# EAGLE design FLK01A (EAGLE 6.5.0)
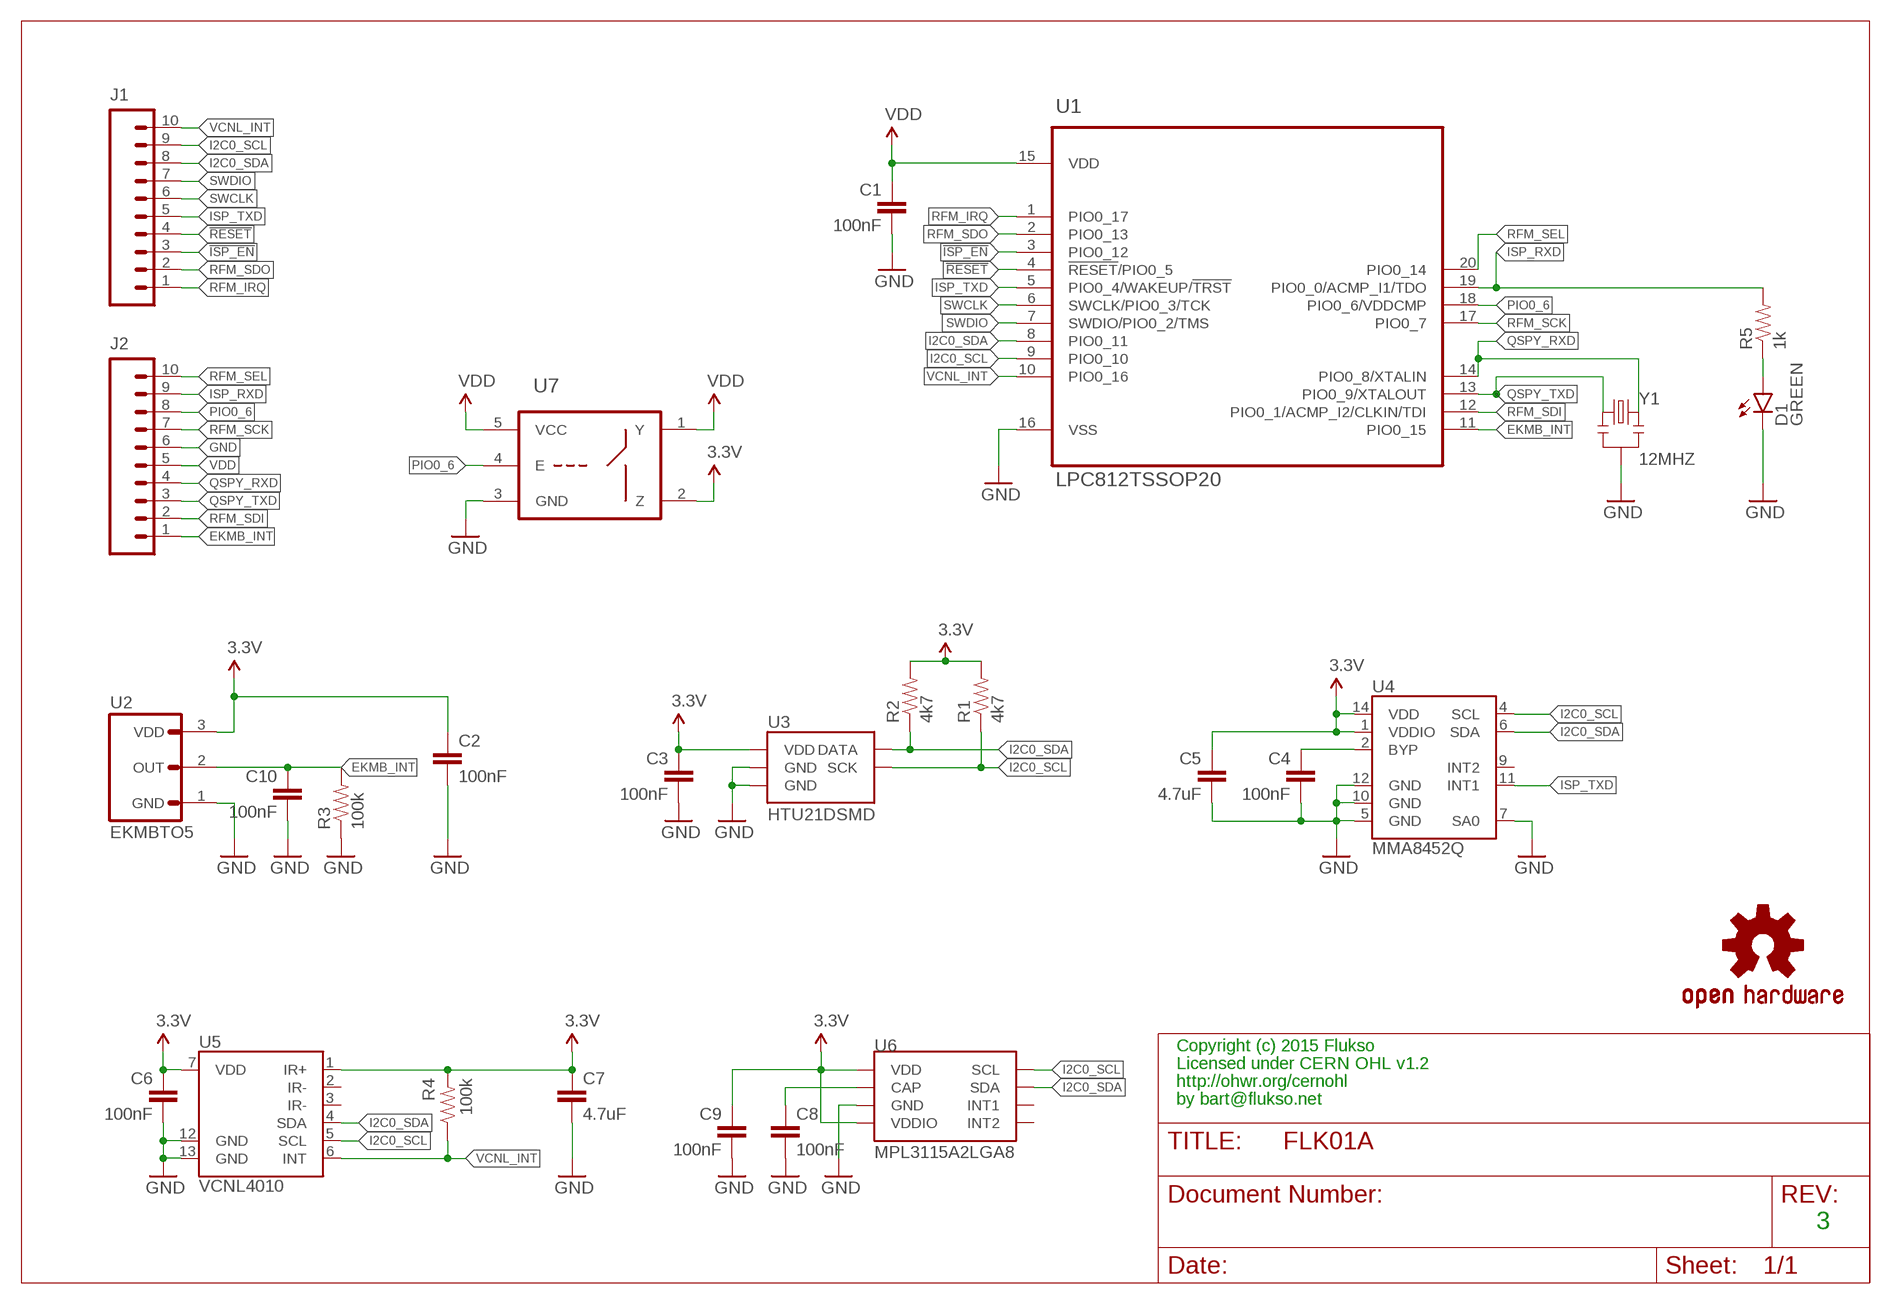
[diagram p0: schematic, sheet 1]

## Parts
C1  100nF  CAP0402-CAP  [0402-CAP]
C2  100nF  CAP0402-CAP  [0402-CAP]
C3  100nF  CAP0402-CAP  [0402-CAP]
C4  100nF  CAP0402-CAP  [0402-CAP]
C5  4.7uF  CAP0805-CAP  [C0805K]
C6  100nF  CAP0402-CAP  [0402-CAP]
C7  4.7uF  CAP0805-CAP  [C0805K]
C8  100nF  CAP0402-CAP  [0402-CAP]
C9  100nF  CAP0402-CAP  [0402-CAP]
C10  100nF  CAP0402-CAP  [0402-CAP]
D1  GREEN  LED-GREEN0603  [LED-0603]
J1  M10SMD_MALE_SHORT  [1X10_SMD_MALE_SHORT]
J2  M10SMD_MALE_SHORT  [1X10_SMD_MALE_SHORT]
R1  4k7  RESISTOR0402-RES  [0402-RES]
R2  4k7  RESISTOR0402-RES  [0402-RES]
R3  100k  RESISTOR0402-RES  [0402-RES]
R4  100k  RESISTOR0402-RES  [0402-RES]
R5  1k  RESISTOR0402-RES  [0402-RES]
U1  LPC812TSSOP20  [TSSOP20]
U2  EKMBTO5  [TO5]
U3  HTU21DSMD  [HTU21D]
U4  MMA8452Q  [QFN-16_0.5MM]
U5  VCNL4010  [VCNL4010]
U6  MPL3115A2LGA8  [LGA8]
U7  741G66  [SOT353]
U$1  OSHW-LOGOS  [OSHW-LOGO-S]
Y1  12MHZ  RESONATOR8MHZ  [RESONATOR-SMD]

## Nets
3.3V: C2.1 C3.1 C5.1 C6.1 C7.1 C9.1 R1.2 R2.2 R4.2 U2.3(VDD) U3.VDD U4.1(VDDIO) U4.14(VDD) U5.1(IR+) U5.7(VDD) U6.1(VDD) U6.4(VDDIO) U7.2(Z)
!ISP_EN!: J1.3 U1.3(PIO0_12)
!RESET!: J1.4 U1.4(!RESET!/PIO0_5)
EKMB_INT: C10.1 J2.1 R3.2 U1.11(PIO0_15) U2.2(OUT)
GND: C1.2 C2.2 C3.2 C4.2 C5.2 C6.2 C7.2 C8.2 C9.2 C10.2 D1.C J2.6 R3.1 U1.16(VSS) U2.1(GND) U3.7(GND) U3.GND U4.5(GND) U4.7(SA0) U4.10(GND) U4.12(GND) U5.12(GND) U5.13(GND) U6.3(GND) U7.3(GND) Y1.2
I2C0_SCL: J1.9 R1.1 U1.9(PIO0_10) U3.SCK U4.4(SCL) U5.5(SCL) U6.8(SCL)
I2C0_SDA: J1.8 R2.1 U1.8(PIO0_11) U3.DATA U4.6(SDA) U5.4(SDA) U6.7(SDA)
ISP_RXD: J2.9 R5.2 U1.19(PIO0_0/ACMP_I1/TDO)
ISP_TXD: J1.5 U1.5(PIO0_4/WAKEUP/!TRST!) U4.11(INT1)
N$3: C4.1 U4.2(BYP)
N$6: C8.1 U6.2(CAP)
N$8: D1.A R5.1
PIO0_6: J2.8 U1.18(PIO0_6/VDDCMP) U7.4(E)
QSPY_RXD: J2.4 U1.14(PIO0_8/XTALIN) Y1.3
QSPY_TXD: J2.3 U1.13(PIO0_9/XTALOUT) Y1.1
RFM_IRQ: J1.1 U1.1(PIO0_17)
RFM_SCK: J2.7 U1.17(PIO0_7)
RFM_SDI: J2.2 U1.12(PIO0_1/ACMP_I2/CLKIN/TDI)
RFM_SDO: J1.2 U1.2(PIO0_13)
RFM_SEL: J2.10 U1.20(PIO0_14)
SWCLK: J1.6 U1.6(SWCLK/PIO0_3/TCK)
SWDIO: J1.7 U1.7(SWDIO/PIO0_2/TMS)
VCNL_INT: J1.10 R4.1 U1.10(PIO0_16) U5.6(INT)
VDD: C1.1 J2.5 U1.15(VDD) U7.1(Y) U7.5(VCC)
Unconnected: U4.9(INT2) U5.2(IR-) U5.3(IR-) U6.5(INT2) U6.6(INT1)

## Notes on the sheet
- Copyright (c) 2015 Flukso
- Licensed under CERN OHL v1.2
- http://ohwr.org/cernohl
- by bart@flukso.net
- 3

## Library data of the parts
C1-C10 = flukso:CAP: Capacitor Standard 0603 ceramic capacitor, and 0.1" leaded capacitor.
D1 = SparkFun-LED:LED-GREEN: Various green LEDs Green LEDs used in SFE Production 0603- DIO-00821 LARGE- DIO-00862 LILYPAD- DIO-09910; PROD_ID: DIO-00821
J1 J2 = flukso:M10: Header 10 Standard 10-pin 0.1" header. Use with straight break away headers (SKU : PRT-00116), right angle break away headers (PRT-00553), swiss pins (PRT-00743), machine pins (PRT-00117), and female headers (PRT-00115).
R1-R5 = SparkFun-Passives:RESISTOR: Resistor Basic schematic elements and footprints for 0603, 1206, and PTH resistors.
U1 = flukso:LPC812: IC, 32-bit ARM Cortex-M0+ microcontroller 16 kB flash and 4 kB SRAM
U2 = flukso:EKMB
U3 = flukso:HTU21D
U4 = SparkFun-Sensors:MMA8452Q: MMA8452Q 3-Axis, 12/8-bit Digital Accelerometer Supply Voltage: 1.6-3.6V Range: +/- 2g, 4g, 8g Interface: I2C, 12-bit and 8-bit ODR: 1.56 Hz - 800 Hz Package: QFN-16 http://cache.freescale.com/files/sensors/doc/data_sheet/MMA8452Q.pdf; PROD_ID: IC-10769
U5 = flukso:VCNL4010: Fully integrated proximity and ambient light sensor with infrared emitter and I2C interface
U6 = SparkFun-Sensors:MPL3115A2: Altimeter/Pressure Sensor, I2C, 1.95V-3.6V supply, 50 to 110kPa
U7 = flukso:74*1G66: Analog switch
U$1 = sparkFun:OSHW-LOGO: Open Source Hardware Logo This logo indicates the piece of hardware it is found on incorporates a OSHW license and/or adheres to the definition of open source hardware found here: http://freedomdefined.org/OSHW
Y1 = SparkFun-FreqCtrl:RESONATOR: Resonator Small SMD resonator. Used, eg, on the Arduino Pro/ Pro Mini boards. 8MHz- XTAL-08895 16MHz- XTAL-08900; PROD_ID: XTAL-08895; VALUE: 8MHZ

## Net classes
0 default: width 0.2 mm
1 power: width 0.305 mm

## Board
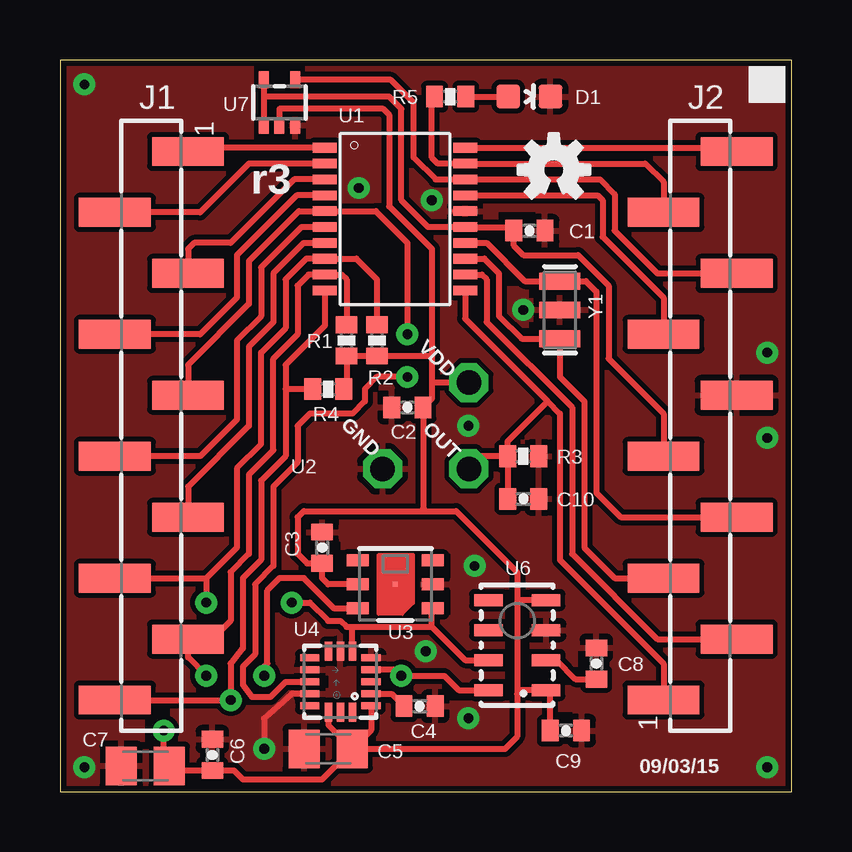
[diagram p1: board, top side]
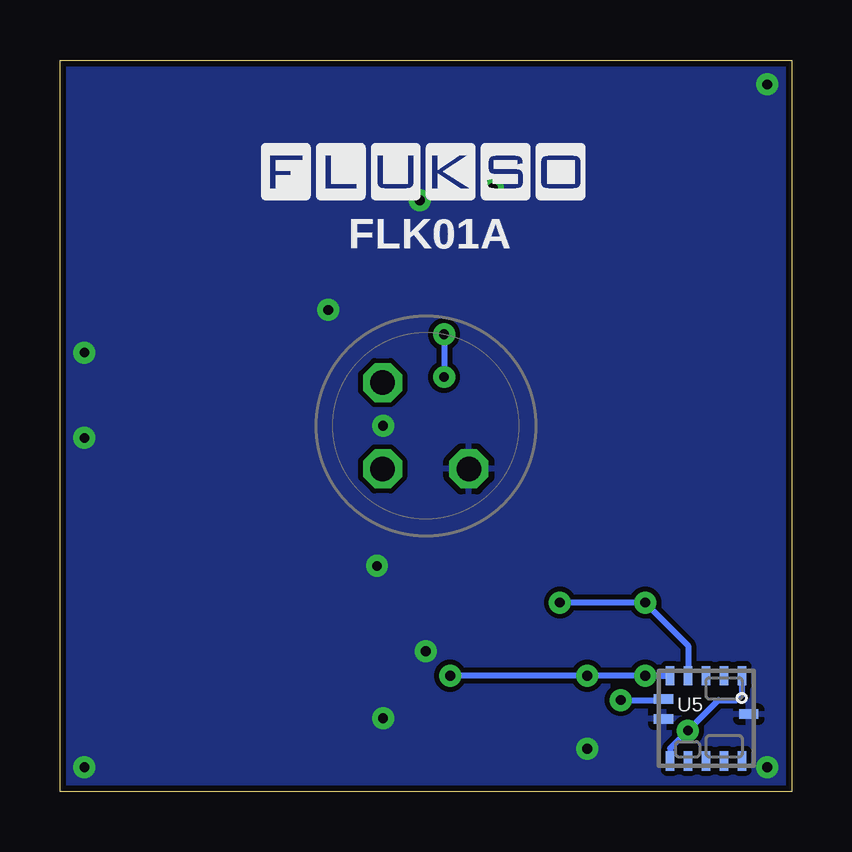
[diagram p2: board, bottom side, seen from below]

Size 30.48 x 30.48 mm. Coordinates in mm from the lower left corner, seen from the top.
Outline: 0,0 30.48,0 30.48,30.48 0,30.48 0,0
Copper layers (1*16): Top 0.035mm / dielectric 1.5mm / Bottom 0.035mm
Design rules "sparkfun": minimum track width 8mil, minimum drill 16mil, track to track 8mil, track to pad 8mil, pad to pad 8mil, via to via 8mil, smd to smd 8mil, copper to edge 10mil, drill to drill 8mil, minimum pad ring 12mil, minimum via ring 10mil, stop-mask expansion 4mil, vias tented up to drill 25mil, thermal gap 10mil
tRestrict: area 11.4,9.9 to 11.7,10.4; area 18.5,3.8 to 18.8,8.4; area 19.3,4.6 to 19.6,7.6; area 18.3,23.9 to 19.8,24.1; area 18.8,12.7 to 19.8,13.5; area 20.1,12.7 to 20.6,13.5; area 18.5,21.1 to 19,21.3; area 19.3,19.1 to 19.8,19.3; area 19.6,19.3 to 19.8,19.6; area 19.6,20.6 to 19.8,21.1; area 15,8.1 to 16,8.4; area 16,8.9 to 16.3,9.9; 8 more areas

### Footprints (pad centres in the part's own frame; a part is rotated, then mirrored left to right if it is on the bottom)
0402-CAP = smd 0.7 x 0.9: 1 -0.65,0; 2 0.65,0
C0805K = smd 1.3 x 1.6: 1 -1,0; 2 1,0
LED-0603 = smd 1 x 1: A 0,-0.877; C 0,0.877
1X10_SMD_MALE_SHORT = smd 1.2 x 2.997: 1 0,1.524; 2 2.54,-1.524; 3 5.08,1.524; 4 7.62,-1.524; 5 10.16,1.524; 6 12.7,-1.524; 7 15.24,1.524; 8 17.78,-1.524; 9 20.32,1.524; 10 22.86,-1.524
0402-RES = smd 0.7 x 0.9: 1 -0.65,0; 2 0.65,0
TSSOP20 = smd 1 x 0.4: 1 -2.937,2.693; 2 -2.937,2.032; 3 -2.937,1.372; 4 -2.937,0.712; 5 -2.937,0.051; 6 -2.937,-0.609; 7 -2.937,-1.27; 8 -2.943,-1.93; 9 -2.937,-2.59; 10 -2.937,-3.251; 11 2.905,-3.251; 12 2.905,-2.59; 13 2.911,-1.93; 14 2.905,-1.27; 15 2.905,-0.609; 16 2.905,0.051; 17 2.905,0.712; 18 2.905,1.372; 19 2.905,2.032; 20 2.905,2.693
TO5 = drill 1.016 octagon: 1 0,-2.54; 2 2.54,0; 3 0,2.54
HTU21D = smd 0.2 x 0.2: 7 0,0 | smd 0.927 x 0.5: DATA 1.563,-1; GND 1.563,0; NC@1 -1.563,1; NC@6 1.563,1; SCK -1.563,-1; VDD -1.563,0
QFN-16_0.5MM = smd 0.8 x 0.3: 1 -1.275,1; 2 -1.275,0.5; 3 -1.275,0; 4 -1.275,-0.5; 5 -1.275,-1; 9 1.275,-1; 10 1.275,-0.5; 11 1.275,0; 12 1.275,0.5; 13 1.275,1 | smd 0.3 x 0.8: 6 -0.5,-1.275; 7 0,-1.275; 8 0.5,-1.275; 14 0.5,1.275; 15 0,1.275; 16 -0.5,1.275
VCNL4010 = smd 0.35 x 0.805: 1 -1.5,-1.772; 2 -0.75,-1.772; 3 0,-1.772; 4 0.75,-1.772; 5 1.5,-1.772; 7 1.5,1.772; 8 0.75,1.772; 9 0,1.772; 10 -0.75,1.772; 11 -1.5,1.772 | smd 0.805 x 0.4: 6 1.772,-0.805; 12 -1.772,-0.175; 13 1.772,0.024
LGA8 = smd 1.2 x 0.5: 1 -1.2,1.875; 2 -1.2,0.625; 3 -1.2,-0.625; 4 -1.2,-1.875; 5 1.2,-1.875; 6 1.2,-0.625; 7 1.2,0.625; 8 1.2,1.875
SOT353 = smd 0.42 x 0.7: 1 -0.65,-0.95; 2 0,-0.95; 3 0.65,-0.95; 4 0.65,0.95; 5 -0.65,0.95
RESONATOR-SMD = smd 0.7 x 1.7: 1 -1.2,0; 2 0,0; 3 1.2,0

### Placement (x,y rotation side)
C1  19.56,23.37 0 top
C2  14.48,16 180 top
C3  10.92,10.16 90 top
C4  14.99,3.56 0 top
C5  11.18,1.78 180 top
C6  6.35,1.52 90 top
C7  3.56,1.07 180 top
C8  22.35,5.33 90 top
C9  21.08,2.54 0 top
C10  19.3,12.19 0 top
D1  19.56,28.96 270 top
J1  3.81,26.67 270 top
J2  26.67,3.81 90 top
R1  11.94,18.8 270 top
R2  13.21,18.8 270 top
R3  19.3,13.97 180 top
R4  11.18,16.76 0 top
R5  16.26,28.96 180 top
U1  13.97,24.13 0 top
U2  15.24,15.24 315 top
U3  13.97,8.64 0 top
U4  11.68,4.57 180 top
U5  3.56,3.05 180 bottom
U6  19.05,6.1 180 top
U7  9.14,28.7 0 top
U$1  20.57,25.91 0 top
U$2  [FLUKSO_LOGO_MEDIUM]  22.1,24.64 0 bottom
Y1  20.83,20.07 90 top

### Tracks (layer width: path | path; a pad name or v marks a point on that pad's centre or on a via)
3.3V  (via drill 0.41 pad 0.61)
  Top 0.254: 19.05,7.87 19.05,9.14 16.51,11.68 15.24,11.68 | 19.05,7.87 19.05,4.06 | U6.4 19.15,7.97 19.05,7.87 | 19.05,4.06 19.21,4.22 U6.1 20.43,4.04 C9.1 | 19.05,4.06 19.05,2.29 18.54,1.78 C5.1 | U7.2 9.14,28.45 13.46,28.45 13.72,28.19 13.72,24.38 15.49,22.61 15.49,18.16 | U3.VDD 11.18,8.64 10.92,8.89 C3.1 10.3,9.51 9.91,9.91 9.91,11.43 10.16,11.68 15.24,11.68 | 15.24,11.68 15.13,11.8 C2.1 15.49,16.37 15.49,17.02 | v4.32,2.54 4.32,1.07 C7.1 4.56,0.87 C6.1 7.25,0.87 7.62,0.51 10.92,0.51 12.18,1.76 C5.1 | R4.2 11.94,17.13 R1.2 R2.2 13.21,18.16 15.49,18.16 | 15.49,18.16 15.49,17.02 | U2.3 15.51,17.04 15.49,17.02 | U4.14 11.18,2.77 C5.1 | U4.1 12.96,2.56 C5.1
  Bottom 0.254: U5.7 5.06,1.8 v4.32,2.54 3.05,3.81 2.29,3.81 2.06,4.04 U5.1
!ISP_EN!
  Top 0.254: U1.3 9.75,25.5 7.11,22.86 5.59,22.86 5.33,22.61 J1.3
!RESET!
  Top 0.254: U1.4 9.86,24.84 7.37,22.35 7.37,20.57 5.84,19.05 J1.4
EKMB_INT
  Top 0.254: 16.97,20.88 U1.11 16.88,19.7 20.32,16.26 | R3.2 17.56,13.97 U2.2 | R3.2 C10.1 | J2.1 25.15,5.33 20.83,9.65 20.83,15.75 20.32,16.26 | R3.2 18.65,14.59 20.32,16.26
GND  (via drill 0.41 pad 0.61)
  Top 0.254: 16.46,24.18 U1.16 | U4.12 9.65,4.06 8.51,3.05 v8.51,1.78
  other vias: 19.3,20.07 15.49,24.64 29.46,18.29 29.46,14.73 1.02,29.46 1.02,1.02 17.27,9.4 29.46,1.02 17.02,15.24 17.02,3.05 12.45,25.15 15.24,5.84
  pour Top: 0,0 0,30.48 30.48,30.48 30.48,0
  pour Bottom: 0,0 0,30.48 30.48,30.48 30.48,0
I2C0_SCL  (via drill 0.41 pad 0.61)
  Top 0.254: R1.1 11.94,21.34 11.73,21.54 U1.9 10.36,21.54 9.91,21.08 9.91,19.05 8.89,18.03 8.89,14.22 7.87,13.21 7.87,9.91 7.11,9.14 7.11,7.11 6.35,6.35 J1.9 5.33,5.59 v6.1,4.83 | U3.SCK 12.39,7.62 11.43,7.62 10.16,8.89 9.14,8.89 8.64,8.38 8.64,5.33 8.51,5.21 v8.51,4.83 | U6.8 16.61,4.22 16.01,4.82 14.22,4.82 v14.22,4.83 13.98,5.07 U4.4
  Bottom 0.254: v6.1,4.83 v8.51,4.83 v14.22,4.83 | v6.1,4.83 6.34,4.82 | v6.1,4.83 v6.09,4.82 U5.5
I2C0_SDA  (via drill 0.41 pad 0.61)
  Top 0.254: R2.1 13.21,21.34 12.34,22.2 U1.8 10.26,22.2 9.4,21.34 9.4,19.3 8.38,18.29 8.38,14.48 7.37,13.46 7.37,10.16 6.1,8.89 | J1.8 6.1,8.89 | v9.65,7.87 10.41,7.87 11.18,7.11 11.68,7.11 11.94,6.86 | 15.49,6.86 16.88,5.47 U6.7 | 11.94,6.86 12.19,6.86 | 12.19,6.86 15.49,6.86 | 11.93,6.85 11.94,6.86 | 15.49,6.86 15.49,7.6 U3.DATA | 6.1,8.89 v6.1,7.87 | U4.6 12.18,6.85 12.19,6.86
  Bottom 0.254: v9.65,7.87 v6.1,7.87 4.31,6.08 U5.4
ISP_RXD
  Top 0.254: J2.9 25.15,25.4 24.38,26.16 U1.19 15.75,26.16 15.49,26.42 15.49,28.84 R5.2
ISP_TXD  (via drill 0.41 pad 0.61)
  Top 0.254: J1.5 5.33,17.78 7.87,20.32 7.87,22.1 9.96,24.18 U1.5 13.16,24.18 14.48,22.86 v14.48,19.05 | v14.48,17.27 13.21,17.27 12.7,16.76 12.7,16.26 12.19,15.75 10.41,15.75 9.91,15.24 9.91,13.72 8.89,12.7 8.89,9.4 8.13,8.64 8.13,5.71 7.62,5.21 7.62,4.45 8,3.94 8.76,3.94 9.4,4.57 U4.11
  Bottom 0.254: v14.48,19.05 v14.48,17.27
N$3
  Top 0.254: U4.2 13.82,4.07 C4.1
N$6
  Top 0.254: U6.2 20.69,5.47 21.48,4.68 C8.1
N$8
  Top 0.254: R5.1 D1.A
PIO0_6
  Top 0.254: J2.8 24.89,21.59 23.11,23.37 23.11,24.89 22.5,25.5 U1.18 15.65,25.5 14.73,26.42 14.73,28.7 13.78,29.65 U7.4 9.86,29.46
QSPY_RXD
  Top 0.254: U1.14 17.78,22.86 19.37,21.27 Y1.3 21.91,21.27 22.35,20.83 22.35,12.45 23.37,11.43 J2.4
QSPY_TXD
  Top 0.254: U1.13 17.68,22.2 18.29,21.59 18.29,19.81 19.23,18.87 Y1.1 20.83,17.27 21.84,16.26 21.84,10.16 23.11,8.89 J2.3
RFM_IRQ
  Top 0.254: J1.1 5.49,26.82 U1.1
RFM_SCK
  Top 0.254: U1.17 22.4,24.84 22.61,24.64 22.61,23.11 25.15,20.57 J2.7
RFM_SDI
  Top 0.254: U1.12 17.58,21.54 17.78,21.34 17.78,19.56 21.34,16 21.34,9.91 24.89,6.35 J2.2
RFM_SDO
  Top 0.254: U1.2 7.87,26.16 5.84,24.13 J1.2
RFM_SEL
  Top 0.254: U1.20 28.04,26.82 J2.10
SWCLK
  Top 0.254: U1.6 10.06,23.52 8.38,21.84 8.38,19.81 7.37,18.8 7.37,15.49 5.84,13.97 J1.6
SWDIO
  Top 0.254: U1.7 10.16,22.86 8.89,21.59 8.89,19.56 7.87,18.54 7.87,15.24 5.33,12.7 J1.7
VCNL_INT  (via drill 0.41 pad 0.61)
  Top 0.254: U1.10 11.03,19.41 9.4,17.78 9.4,16.76 | 9.4,16.76 9.4,13.97 8.38,12.95 8.38,9.65 7.62,8.89 7.62,5.97 7.11,5.33 v7.11,3.81 J1.10 | R4.1 9.4,16.76
  Bottom 0.254: v7.11,3.81 5.37,3.81 U5.6
VDD
  Top 0.254: J2.5 25.15,15.75 22.86,18.03 22.86,21.08 21.59,22.35 19.3,22.35 18.91,22.75 C1.1 18.75,23.52 U1.15 15.34,23.52 14.22,24.64 14.22,28.45 13.72,28.96 8.49,28.96 | U7.5 8.49,28.96 | 8.49,28.96 U7.1

### Text on the board
tPlace: r3 | 09/03/15
bPlace: FLK01A